# Altium project Altium_008_ESCDesignUdemyV1.PrjPcb
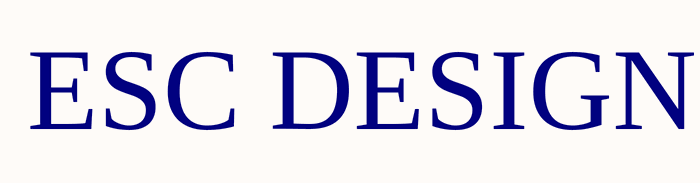
[diagram p0: Introduction.SchDoc]
4 sheets, 57 parts. Net scope: flat (ports and power ports of the same name join across sheets).
Board file: PCB1.PcbDoc
Sheets:
  Introduction.SchDoc
  MP2307.SchDoc
  MosfetDrivers.SchDoc
  Atmega328PB.SchDoc

## Sheet Introduction.SchDoc
size 420 x 297 mm; Author: Denizhan ALTAY; SheetNumber: 1; SheetTotal: 4

### Notes on the sheet
- ESC DESIGN
- THIS DOCUMENT AND THE DATA DISCLOSED HEREIN OR
- HEREWITH IS THE PROPERTY OF ALTIUM LIMITED AND MAY
- BE FREELY DISTRIBUTED IN WHOLE. NO RIGHTS ARE
- RESERVED OR EXPRESS OR IMPLIED WARANTEE GIVEN.
- Title :
- Size :
- Date :
- A3
- Sheet Number :
- Time :
- Revision :
- Author :
- File :

## Sheet MP2307.SchDoc
size 420 x 297 mm; Author: Denizhan ALTAY; SheetNumber: 2; SheetTotal: 4
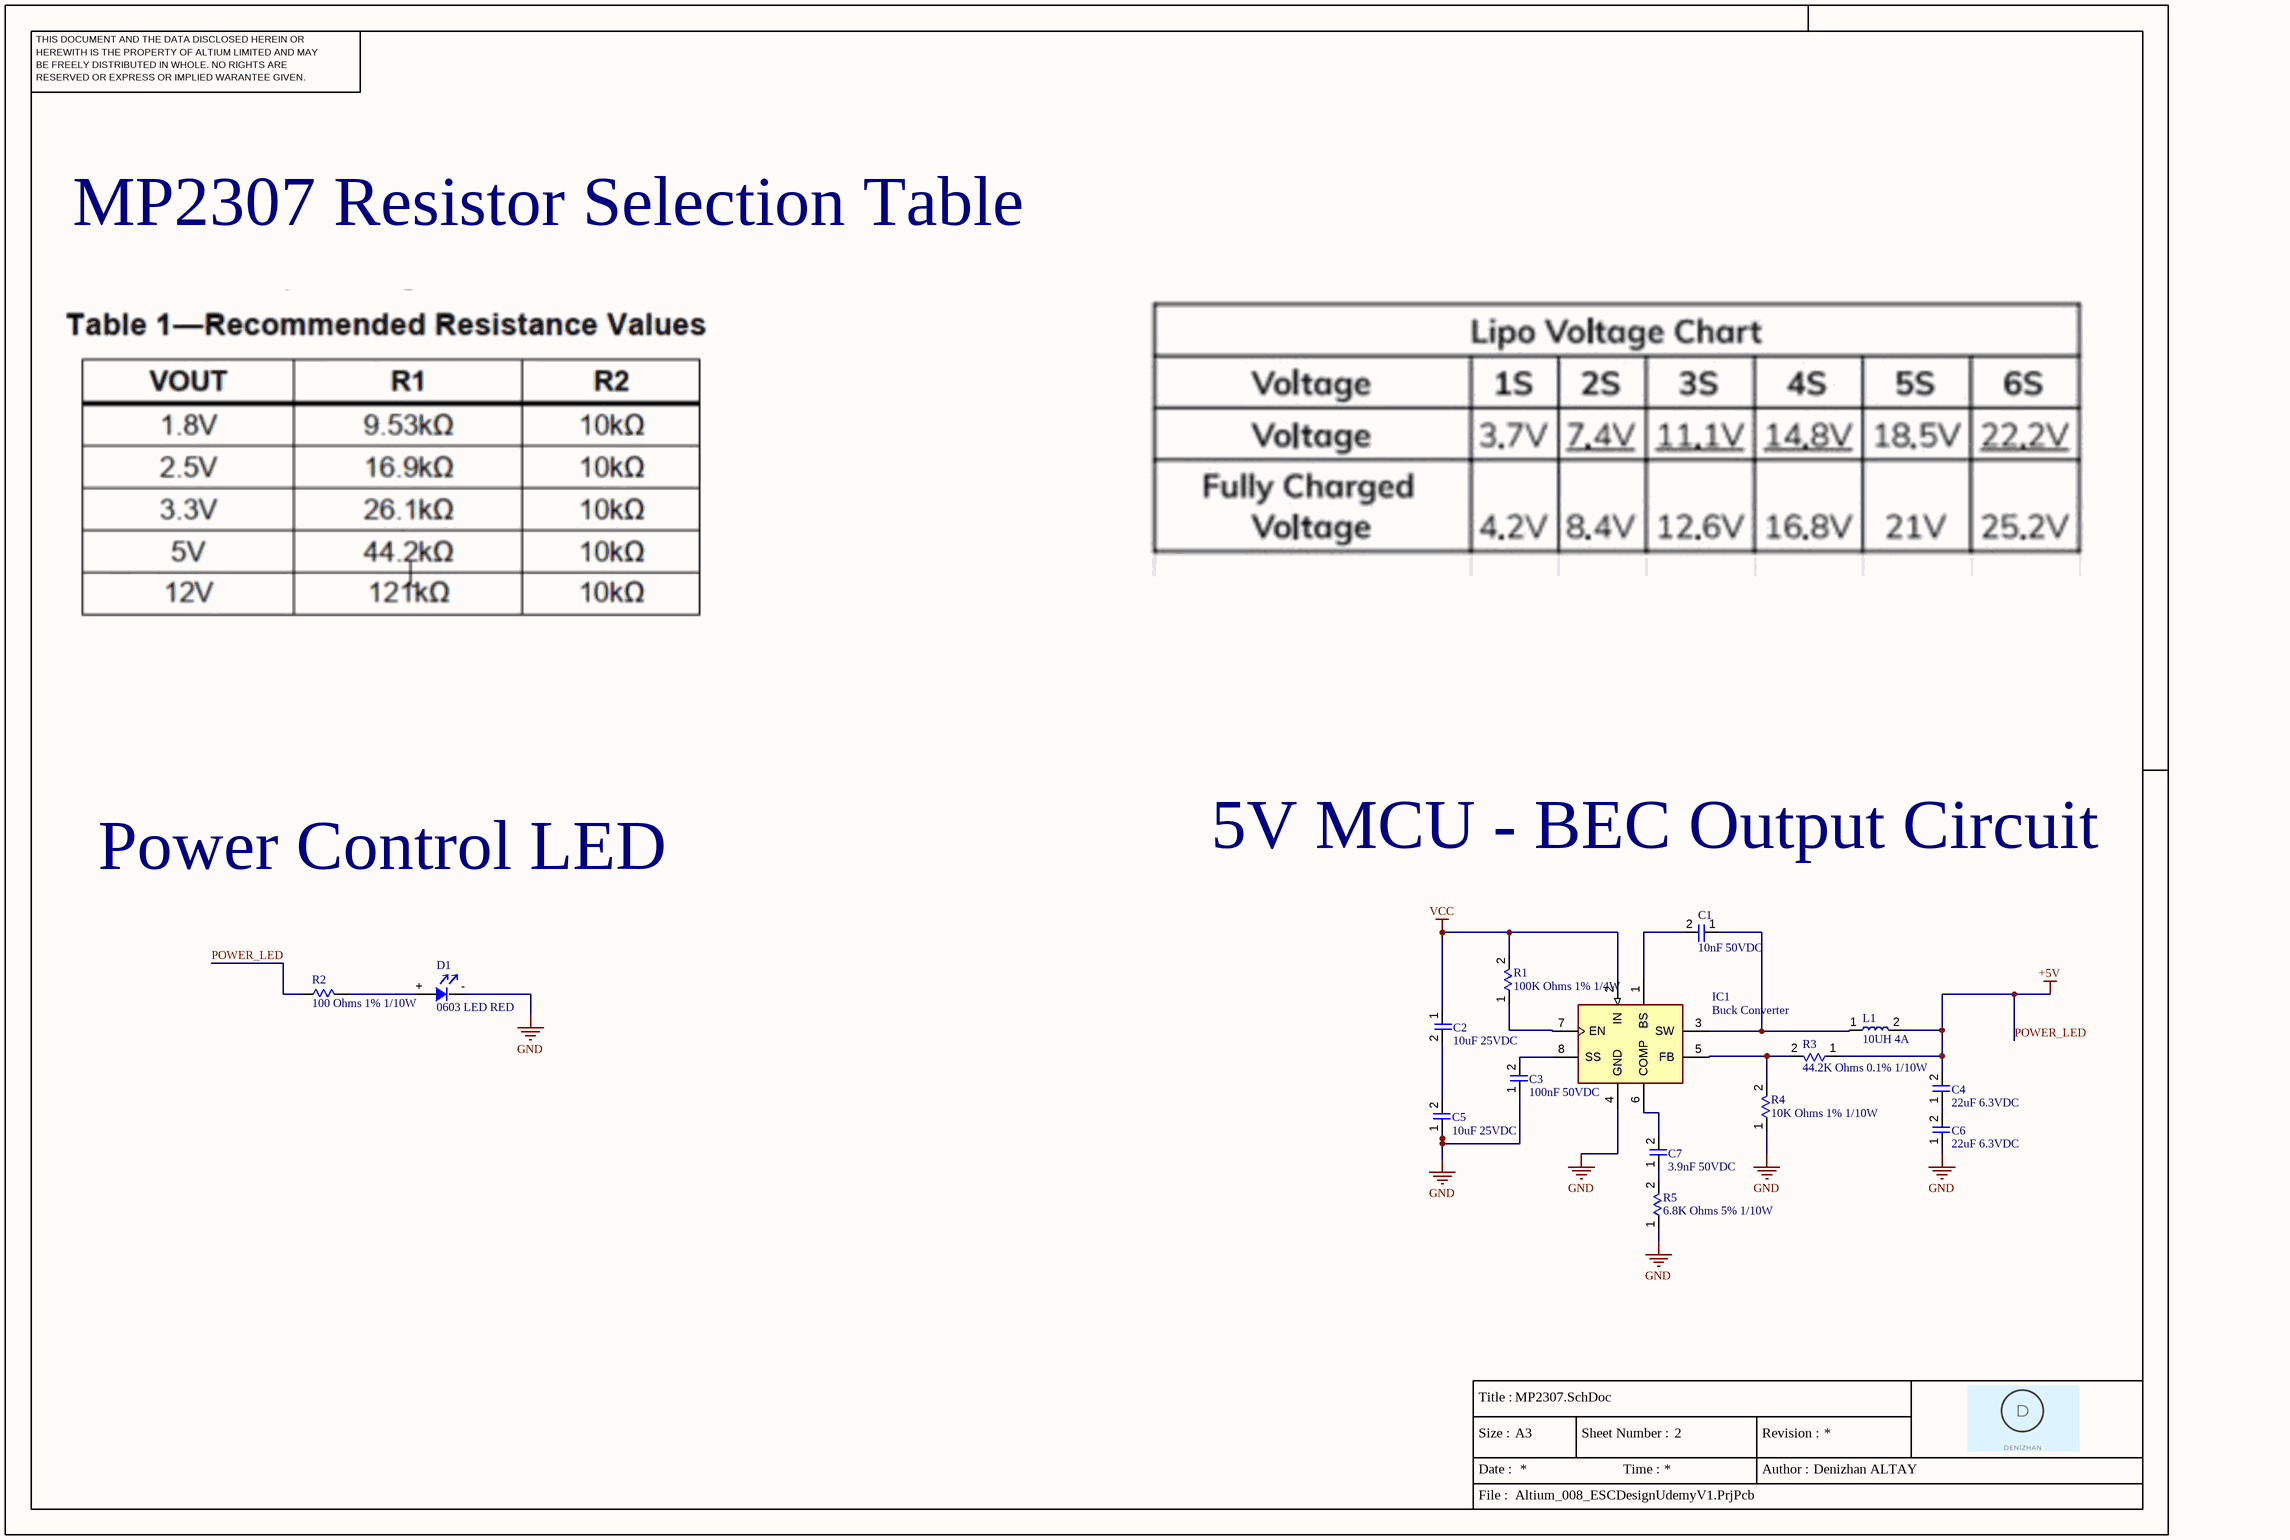
[diagram p1: MP2307.SchDoc]

### Parts
C1  10nF 50VDC  [0603_UnP_Capacitor]
C2  10uF 25VDC  [0603_UnP_Capacitor]
C3  100nF 50VDC  [0603_UnP_Capacitor]
C4  22uF 6.3VDC  [0603_UnP_Capacitor]
C5  10uF 25VDC  [0603_UnP_Capacitor]
C6  22uF 6.3VDC  [0603_UnP_Capacitor]
C7  3.9nF 50VDC  [0603_UnP_Capacitor]
D1  0603 LED RED  [LED Diode 0603]
IC1  Buck Converter  [MP2307_SOIC127P600X170_HS-9N]
L1  10UH 4A  [IHLP-2525CZ-11_Inductor]
R1  100K Ohms 1% 1/4W  [0603_Resistor_Case]
R2  100 Ohms 1% 1/10W  [0603_Resistor_Case]
R3  44.2K Ohms 0.1% 1/10W  [0603_Resistor_Case]
R4  10K Ohms 1% 1/10W  [0603_Resistor_Case]
R5  6.8K Ohms 5% 1/10W  [0603_Resistor_Case]

### Nets
GND: C3.1 C5.1 C6.1 D1.- IC1.4(GND) R4.1 R5.1
POWER_LED: C4.2 L1.2 R2.1 R3.1  [also labelled +5V]
VCC: C2.1 IC1.2(IN) R1.2
NetC1_1: C1.1 IC1.3(SW) L1.1
NetC1_2: C1.2 IC1.1(BS)
NetC2_2: C2.2 C5.2
NetC3_2: C3.2 IC1.8(SS)
NetC4_1: C4.1 C6.2
NetC7_1: C7.1 R5.2
NetC7_2: C7.2 IC1.6(COMP)
NetD1_+: D1.+ R2.2
NetIC1_5: IC1.5(FB) R3.2 R4.2
NetIC1_7: IC1.7(EN) R1.1

### Notes on the sheet
- MP2307 Resistor Selection Table
- Power Control LED
- 5V MCU - BEC Output Circuit
- THIS DOCUMENT AND THE DATA DISCLOSED HEREIN OR
- HEREWITH IS THE PROPERTY OF ALTIUM LIMITED AND MAY
- BE FREELY DISTRIBUTED IN WHOLE. NO RIGHTS ARE
- RESERVED OR EXPRESS OR IMPLIED WARANTEE GIVEN.
- Title :
- Size :
- Date :
- A3
- Sheet Number :
- Time :
- Revision :
- Author :
- File :

### Library data of the parts
C1 = CL10B103KB8NNNC - MLCC (1608) 0603 10nF 50VDC ±10% X7R: Manufacturer: SAMSUNG; Capacitor Type: Unpolarized; Max Working Voltage: 50V; Library Ref: Capacitors; Package / Case: 0603; Capacitor Value: 10nF; Part Number: CL10B103KB8NNNC; ComponentLink1Description: New link; ComponentLink1URL: https://www.ozdisan.com/passive-components/resistors/smt-smd-and-chip-resistors/PS03W4F1003T5E/592727
C2 C5 = MCF03MTX250106 - MLCC 0603 10uF 25VDC ±20% X5R: MCF03MTX250106 - MLCC (1608) 0603 10uF 25VDC ±20% X5R; Manufacturer: VIKING; Capacitor Type: Ceramic; Library Ref: Capacitors; Package / Case: 0603; Capacitor Value: 10uF; Part Number: MCF03MTX250106; ComponentLink1Description: New link; ComponentLink1URL: https://www.ozdisan.com/passive-components/resistors/smt-smd-and-chip-resistors/PS03W4F1003T5E/592727; Max Working Voltage: 25VDC
C3 = MCF03KTB500104 - MLCC 0603 100nF 50VDC ±10% X7R: MCF03KTB500104 - MLCC (1608) 0603 100nF 50VDC ±10% X7R; Manufacturer: VIKING; Part Number: MCF03MTX250106; Capacitor Type: Ceramic; Library Ref: Capacitors; Package / Case: 0603; Capacitor Value: 100nF; ComponentLink1Description: New link; ComponentLink1URL: https://www.ozdisan.com/passive-components/resistors/smt-smd-and-chip-resistors/PS03W4F1003T5E/592727; Max Working Voltage: 50VDC
C4 C6 = CL10A226MQ8NRNC - MLCC (1608) 0603 22uF 6.3VDC ±20% X5R: Manufacturer: SAMSUNG; Part Number: CL10B103KB8NNNC; Capacitor Type: Unpolarized; Max Working Voltage: 6.3V; Library Ref: Capacitors; Package / Case: 0603; Capacitor Value: 22uF; ComponentLink1Description: New link; ComponentLink1URL: https://www.ozdisan.com/passive-components/capacitors/smt-smd-and-mlcc-capacitors/CL10B392KB8NNNC/26336
C7 = CL10B392KB8NNNC - MLCC (1608) 0603 3.9nF 50VDC ±10% X7R: Manufacturer: SAMSUNG; Part Number: CL10B103KB8NNNC; Capacitor Type: Unpolarized; Max Working Voltage: 50V; Library Ref: Capacitors; Package / Case: 0603; Capacitor Value: 3.9nF; ComponentLink1Description: New link; ComponentLink1URL: https://www.ozdisan.com/passive-components/capacitors/smt-smd-and-mlcc-capacitors/CL10B392KB8NNNC/26336
D1 = 0603 LED RED: Type: SMD; Library Ref: LED; Package / Case: 0603; Color: Red
IC1 = MP2307: 3A and 4.75V-23V voltage regulator.; Library Ref: Voltage Regulators; Converter Type: Buck; Package / Case: SMD
L1 = IHLP2525CZER100M11 - INDUCTOR FIXED 10UH 4A 71.2MOHM SMD: Inductance Value: 10 µH; Working Voltage (Max): 50V; Inductor Type: Iron Core; Library Ref: Inductors; Package / Case: THT; Rated Current (Max): 4A
R1 = PS03W4F1003T5E - 0603 100K Ohms 1% 1/4W AUTOMOTIV: RES.(1608) 0603 100K Ohms 1% 1/4W AUTOMOTIV PS03W4F1003T5E; Manufacturer: ROYALOHM; Max Working Voltage: 50V; Library Ref: Resistors; Package / Case: 0603; Power (Watts): 1/4W; Resistor Value: 100K Ohms; Part Number: PS03W4F1003T5E; ComponentLink1Description: New link; ComponentLink1URL: https://www.ozdisan.com/passive-components/resistors/smt-smd-and-chip-resistors/PS03W4F1003T5E/592727
R2 = CQ03SAF1000T5E - 0603 100 Ohms 1% 1/10W AUTOMOTIV: Manufacturer: ROYALOHM; Working Voltage (Max): 75V; Library Ref: Resistors; Package / Case: 0603; Power (Watts): 1/10W; Resistor Value: 100 Ohms; Part Number: CQ03SAF1000T5E; ComponentLink1Description: New link; ComponentLink1URL: https://www.ozdisan.com/passive-components/resistors/smt-smd-and-chip-resistors/PS03W4F1003T5E/592727
R3 = TC0325B4422T5F - 0603 44.2K Ohms 0.1% 1/10W 25PPM: TC0325B4422T5F - RES.(1608) 0603 44.2K Ohms 0.1% 1/10W 25PPM; Manufacturer: ROYALOHM; Part Number: RI0603L104JT; Max Working Voltage: 50V; Library Ref: Resistors; Package / Case: 0603; Power (Watts): 1/10W; Resistor Value: 44.2K Ohms; ComponentLink1Description: New link; ComponentLink1URL: https://www.ozdisan.com/passive-components/resistors/smt-smd-and-chip-resistors/PS03W4F1003T5E/592727
R4 = RC0603FR-0710KL - 0603 10K Ohms 1% 1/10W 100PPM: Manufacturer: HOTTECH; Part Number: PS03W4F1003T5E; Max Working Voltage: 75V; Library Ref: Resistors; Package / Case: 0603; Power (Watts): 1/10W; Resistor Value: 10K Ohms; ComponentLink1Description: New link; ComponentLink1URL: https://www.ozdisan.com/passive-components/resistors/smt-smd-and-chip-resistors/PS03W4F1003T5E/592727
R5 = RC0603JR-076K8L - 0603 6.8K Ohms 5% 1/10W 100PPM: Manufacturer: YAGEO; Max Working Voltage: 75V; Library Ref: Resistors; Package / Case: 0603; Power (Watts): 1/10W; Resistor Value: 6.8K Ohms; Part Number: RC0603JR-076K8L; ComponentLink1Description: New link; ComponentLink1URL: https://www.ozdisan.com/passive-components/resistors/smt-smd-and-chip-resistors/PS03W4F1003T5E/592727

## Sheet MosfetDrivers.SchDoc
size 420 x 297 mm; Author: Denizhan ALTAY; SheetNumber: 3; SheetTotal: 4
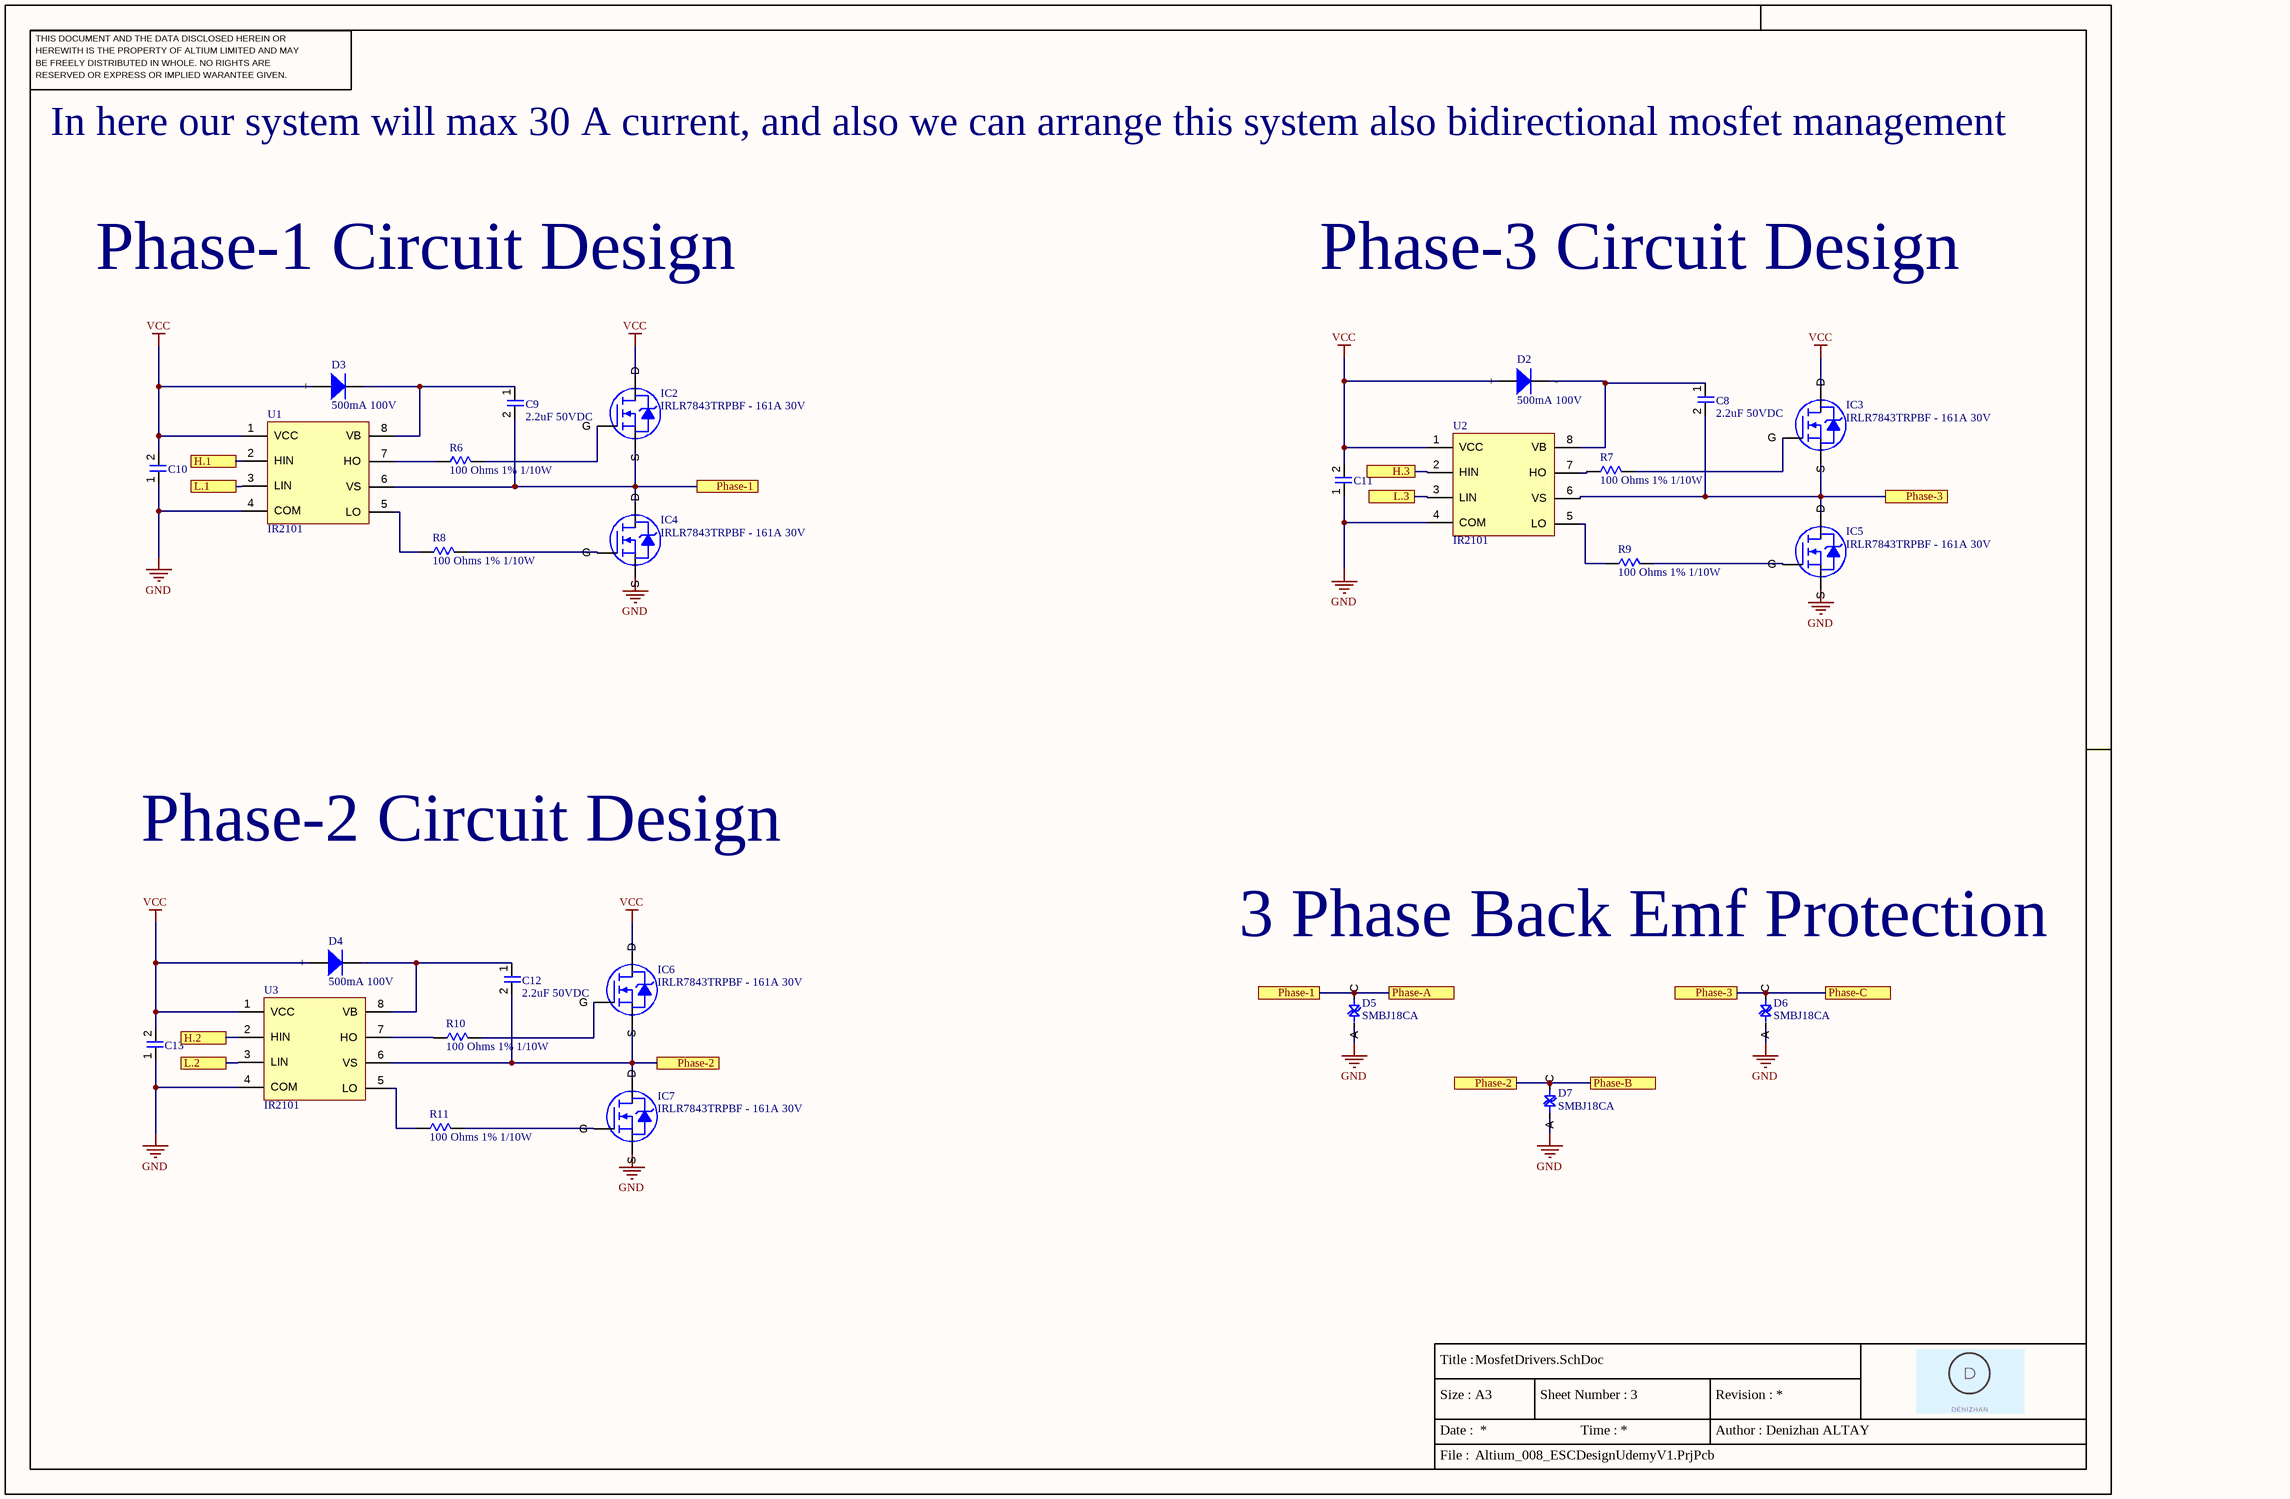
[diagram p2: MosfetDrivers.SchDoc]

### Parts
C8  2.2uF 50VDC  [0603_UnP_Capacitor]
C9  2.2uF 50VDC  [0603_UnP_Capacitor]
C10  10uF 50VDC  [0805_Capacitor_Special_CC0805KKX7R9BB106]  (value not drawn)
C11  10uF 50VDC  [0805_Capacitor_Special_CC0805KKX7R9BB106]  (value not drawn)
C12  2.2uF 50VDC  [0603_UnP_Capacitor]
C13  10uF 50VDC  [0805_Capacitor_Special_CC0805KKX7R9BB106]  (value not drawn)
D2  500mA 100V  [1N4148_Diode]
D3  500mA 100V  [1N4148_Diode]
D4  500mA 100V  [1N4148_Diode]
D5  SMBJ18CA  [SMBJ18CA-TKS]
D6  SMBJ18CA  [SMBJ18CA-TKS]
D7  SMBJ18CA  [SMBJ18CA-TKS]
IC2  IRLR7843TRPBF - 161A 30V  [IRLR7843_DPAK229P991X239-3N]
IC3  IRLR7843TRPBF - 161A 30V  [IRLR7843_DPAK229P991X239-3N]
IC4  IRLR7843TRPBF - 161A 30V  [IRLR7843_DPAK229P991X239-3N]
IC5  IRLR7843TRPBF - 161A 30V  [IRLR7843_DPAK229P991X239-3N]
IC6  IRLR7843TRPBF - 161A 30V  [IRLR7843_DPAK229P991X239-3N]
IC7  IRLR7843TRPBF - 161A 30V  [IRLR7843_DPAK229P991X239-3N]
R6  100 Ohms 1% 1/10W  [0603_Resistor_Case]
R7  100 Ohms 1% 1/10W  [0603_Resistor_Case]
R8  100 Ohms 1% 1/10W  [0603_Resistor_Case]
R9  100 Ohms 1% 1/10W  [0603_Resistor_Case]
R10  100 Ohms 1% 1/10W  [0603_Resistor_Case]
R11  100 Ohms 1% 1/10W  [0603_Resistor_Case]
U1  IR2101  [IR2101_SOIC127P600X175-8N]
U2  IR2101  [IR2101_SOIC127P600X175-8N]
U3  IR2101  [IR2101_SOIC127P600X175-8N]

### Ports
H.1 (see Atmega328PB[4A]), H.2 (see Atmega328PB[3B]), H.3 (see Atmega328PB[3A]), L.1 (see Atmega328PB[4A]), L.2 (see Atmega328PB[3B]), L.3 (see Atmega328PB[3A]), Phase-1 (see Atmega328PB[6B], MosfetDrivers[2B]), Phase-1 (see Atmega328PB[6B], MosfetDrivers[4C]), Phase-2 (see Atmega328PB[6B], MosfetDrivers[2C]), Phase-2 (see Atmega328PB[6B], MosfetDrivers[5C]), Phase-3 (see Atmega328PB[6B], MosfetDrivers[5C]), Phase-3 (see Atmega328PB[6B], MosfetDrivers[6B]), Phase-A, Phase-B, Phase-C

### Nets
GND: C10.1 C11.1 C13.1 D5.2(A) D6.2(A) D7.2(A) IC4.3(S) IC5.3(S) IC7.3(S) U1.4(COM) U2.4(COM) U3.4(COM)
VCC: C10.2 C11.2 C13.2 D2.1(+) D3.1(+) D4.1(+) IC2.4(D) IC3.4(D) IC6.4(D) U1.1(VCC) U2.1(VCC) U3.1(VCC)
NetC8_1: C8.1 D2.2(-) U2.8(VB)
NetC8_2: C8.2 D6.1(C) IC3.3(S) IC5.4(D) U2.6(VS) ; port Phase-3, port Phase-C
NetC9_1: C9.1 D3.2(-) U1.8(VB)
NetC9_2: C9.2 D5.1(C) IC2.3(S) IC4.4(D) U1.6(VS) ; port Phase-1, port Phase-A
NetC12_1: C12.1 D4.2(-) U3.8(VB)
NetC12_2: C12.2 D7.1(C) IC6.3(S) IC7.4(D) U3.6(VS) ; port Phase-2, port Phase-B
NetIC2_1: IC2.1(G) R6.2
NetIC3_1: IC3.1(G) R7.2
NetIC4_1: IC4.1(G) R8.2
NetIC5_1: IC5.1(G) R9.2
NetIC6_1: IC6.1(G) R10.2
NetIC7_1: IC7.1(G) R11.2
NetR6_1: R6.1 U1.7(HO)
NetR7_1: R7.1 U2.7(HO)
NetR8_1: R8.1 U1.5(LO)
NetR9_1: R9.1 U2.5(LO)
NetR10_1: R10.1 U3.7(HO)
NetR11_1: R11.1 U3.5(LO)
NetU1_2: U1.2(HIN) ; port H.1
NetU1_3: U1.3(LIN) ; port L.1
NetU2_2: U2.2(HIN) ; port H.3
NetU2_3: U2.3(LIN) ; port L.3
NetU3_2: U3.2(HIN) ; port H.2
NetU3_3: U3.3(LIN) ; port L.2

### Notes on the sheet
- In here our system will max 30 A current, and also we can arrange this system also bidirectional mosfet management
- Phase-1 Circuit Design
- Phase-3 Circuit Design
- Phase-2 Circuit Design
- 3 Phase Back Emf Protection
- THIS DOCUMENT AND THE DATA DISCLOSED HEREIN OR
- HEREWITH IS THE PROPERTY OF ALTIUM LIMITED AND MAY
- BE FREELY DISTRIBUTED IN WHOLE. NO RIGHTS ARE
- RESERVED OR EXPRESS OR IMPLIED WARANTEE GIVEN.
- Title :
- Size :
- Date :
- A3
- Sheet Number :
- Time :
- Revision :
- Author :
- File :

### Library data of the parts
C8 C9 C12 = UMK107BBJ225KA-T - MLCC 0603 2.2uF 50VDC ±10% X5R: Manufacturer: YUDEN; Capacitor Type: Ceramic; Max Working Voltage: 50V; Library Ref: Capacitors; Package / Case: 0603; Capacitor Value: 2.2uF; Part Number: UMK107BBJ225KA-T; ComponentLink1Description: New link; ComponentLink1URL: https://www.ozdisan.com/passive-components/resistors/smt-smd-and-chip-resistors/PS03W4F1003T5E/592727
C10 C11 C13 = CC0805KKX7R9BB106 - MLCC 0805 10uF 50VDC ±10% X7R: Manufacturer: YAGEO; Capacitor Type: Unpolarized; Library Ref: Capacitors; Package / Case: 0805; Capacitor Value: 10uF; Part Number: CC0805KKX7R9BB106; ComponentLink1Description: New link; ComponentLink1URL: https://www.ozdisan.com/passive-components/capacitors/smt-smd-and-mlcc-capacitors/CL10B392KB8NNNC/26336; Max Working Voltage: 50VDC
D2-D4 = 1N4148-35_AY_10001 - DIODE SWITCHING Single 500mA 100V THT DO35: Library Ref: Diodes; Diode Types: Switching
D5-D7 = SMBJ18CA-TKS - DIODE TVS 600W 18V DO214AA: SMBJ18CA-TKS - DIODE TVS 600W 18V DO214AA (SMB) SMT; MF: THINKING ELECTRONIC; Diode Direction: Bidirectional; Package: SMD; Price: None; Library Ref: Diodes; MP: SMBJ18CA-TKS; Availability: Available; Type: TVS
IC2-IC7 = IRLR7843TRPBF - MOSFET DIS.161A 30V N-CH TO252(DPAK) HEXFET SMT: Mosfet Type: N; Library Ref: Mosfets; Package / Case: D-Pack
R6-R11 = CQ03SAF1000T5E - 0603 100 Ohms 1% 1/10W AUTOMOTIV: as R2 on sheet MP2307; Library Ref: Resistors; Package / Case: 0603; Power (Watts): 1/10W; Resistor Value: 100 Ohms; Part Number: CQ03SAF1000T5E; ComponentLink1Description: New link; ComponentLink1URL: https://www.ozdisan.com/passive-components/resistors/smt-smd-and-chip-resistors/PS03W4F1003T5E/592727
U1-U3 = IR2101: High Speed power MOSFET and IGBT driver; Library Ref: Mosfet Controllers

## Sheet Atmega328PB.SchDoc
size 420 x 297 mm; Author: Denizhan ALTAY; SheetNumber: 4; SheetTotal: 4
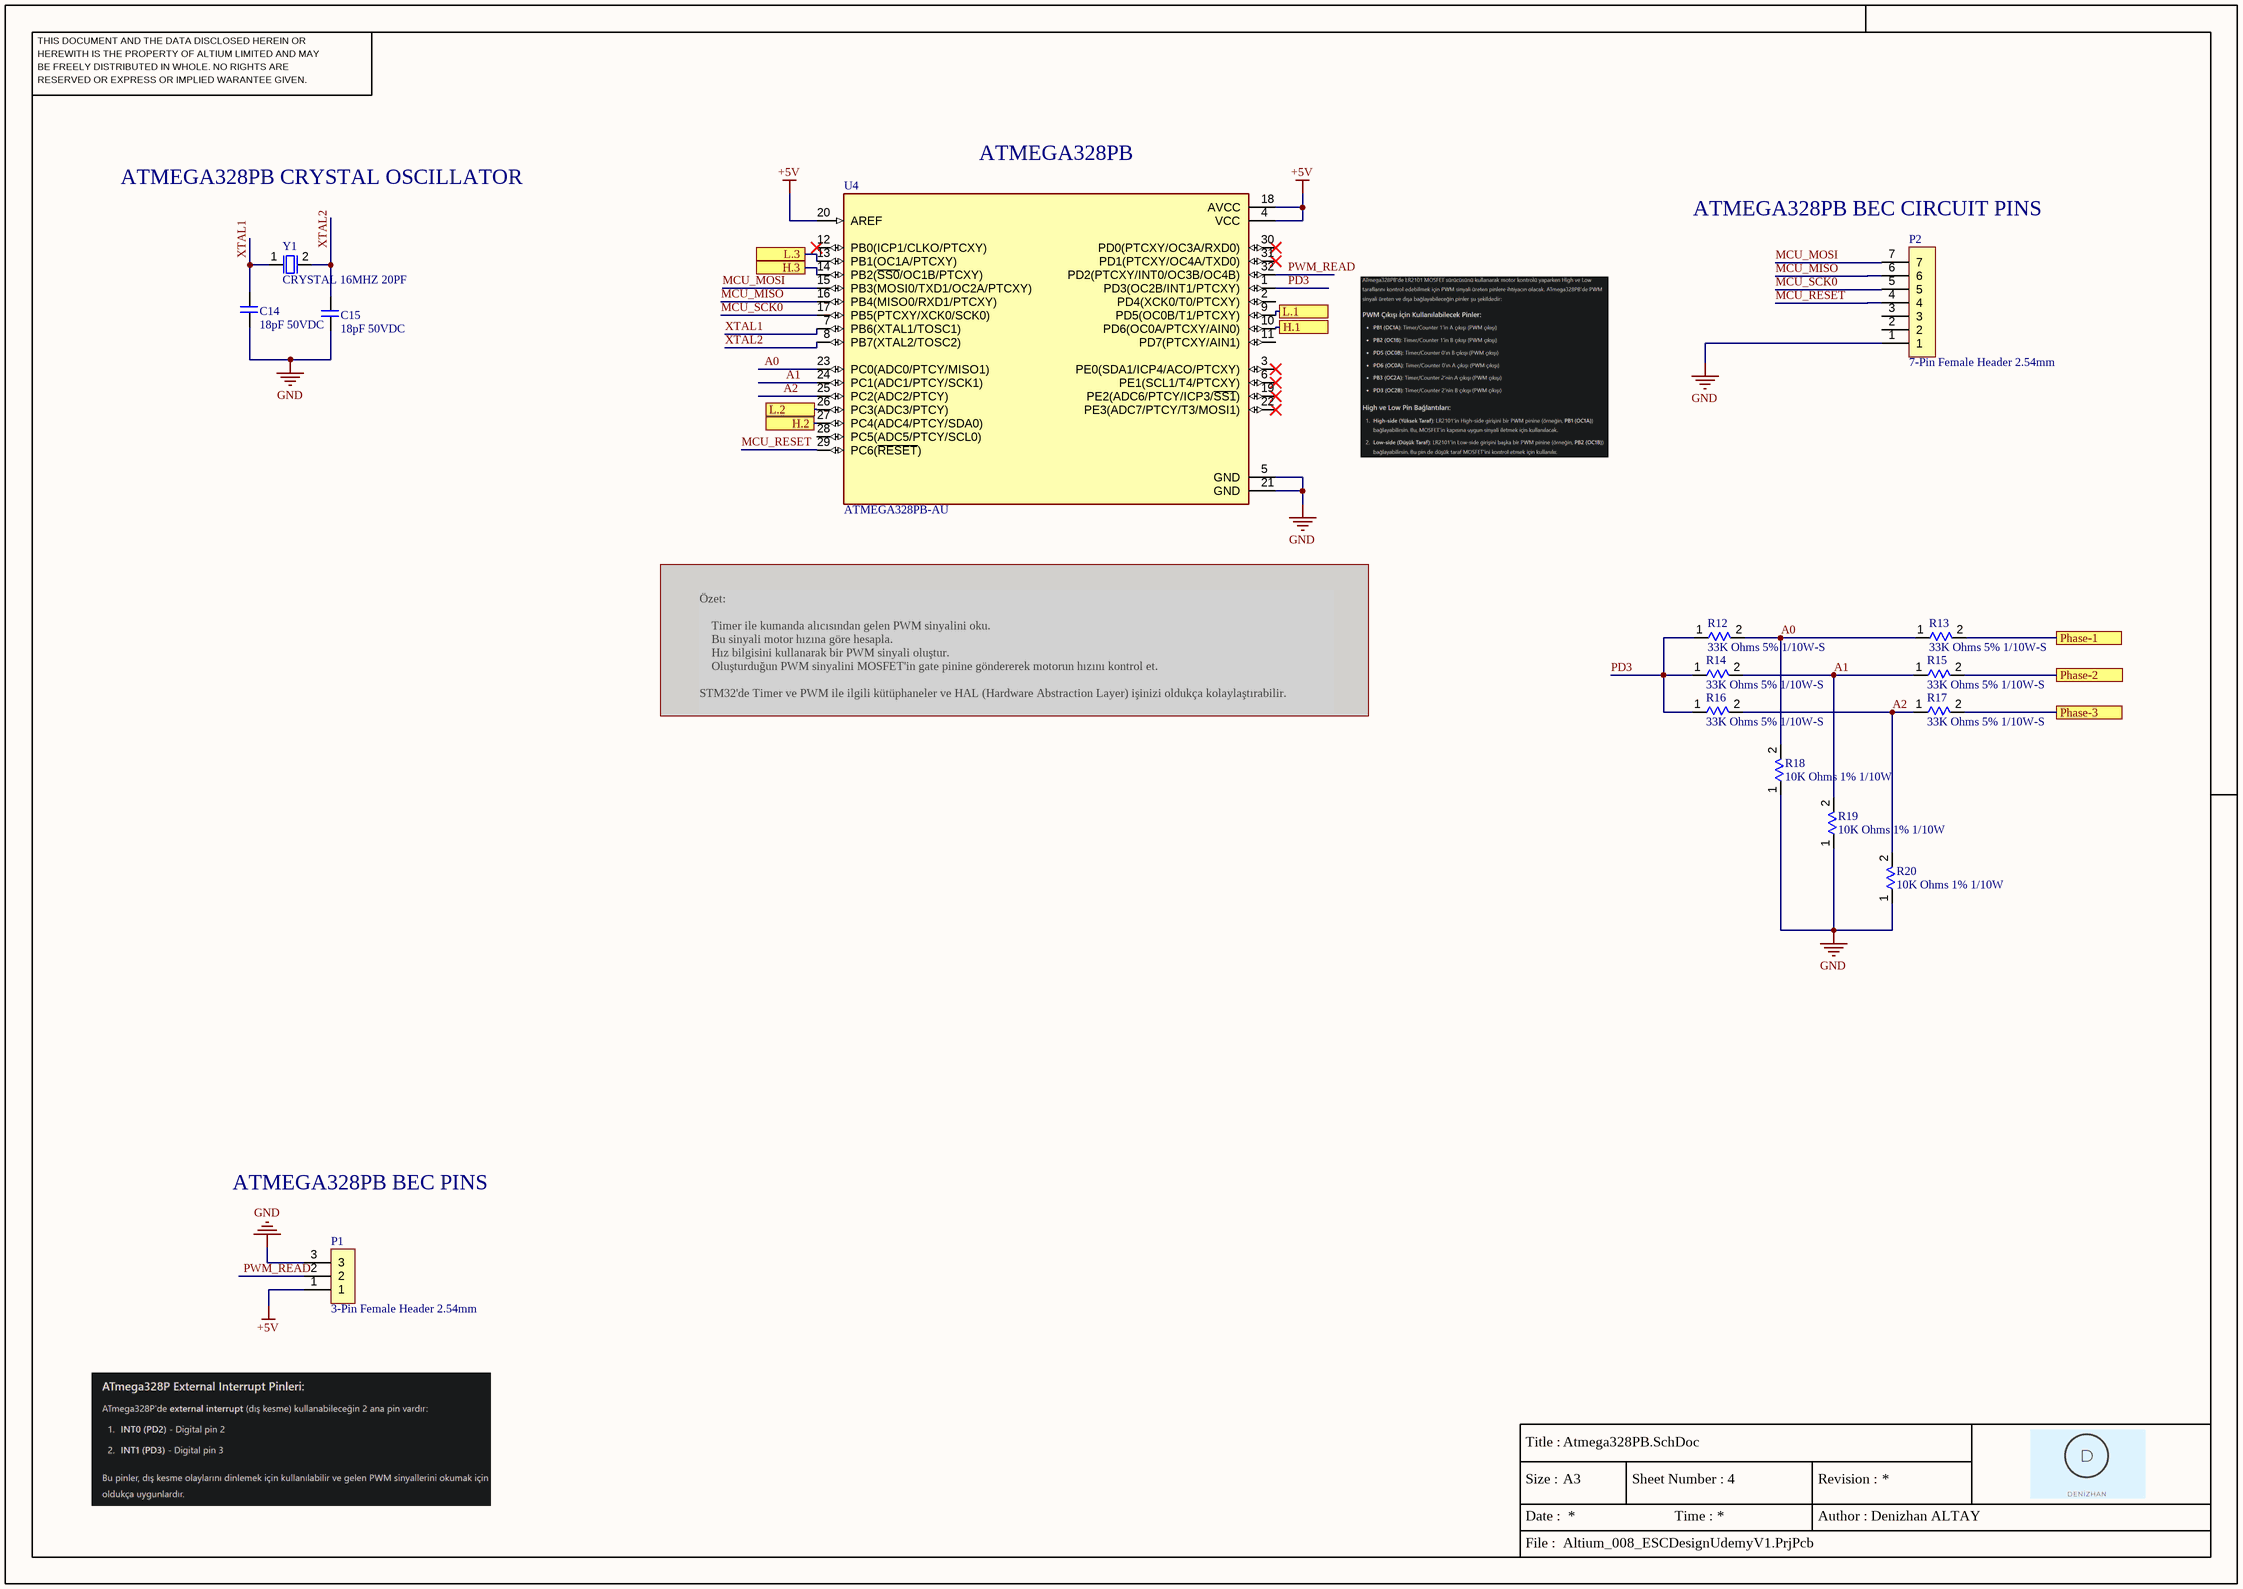
[diagram p3: Atmega328PB.SchDoc]

### Parts
C14  18pF 50VDC  [0603_UNP_Cap]
C15  18pF 50VDC  [0603_UNP_Cap]
P1  3-Pin Female Header 2.54mm  [1x3 Pin Female Header 2.54mm]
P2  7-Pin Female Header 2.54mm  [Single 7-Pin (2.54mm) Female Header]
R12  33K Ohms 5% 1/10W-S  [0603_Resistor_Case]
R13  33K Ohms 5% 1/10W-S  [0603_Resistor_Case]
R14  33K Ohms 5% 1/10W-S  [0603_Resistor_Case]
R15  33K Ohms 5% 1/10W-S  [0603_Resistor_Case]
R16  33K Ohms 5% 1/10W-S  [0603_Resistor_Case]
R17  33K Ohms 5% 1/10W-S  [0603_Resistor_Case]
R18  10K Ohms 1% 1/10W  [0603_Resistor_Case]
R19  10K Ohms 1% 1/10W  [0603_Resistor_Case]
R20  10K Ohms 1% 1/10W  [0603_Resistor_Case]
U4  ATMEGA328PB-AU  [ATMEGA328PB-AU]
Y1  CRYSTAL 16MHZ 20PF  [16MHZ_CrsytalOscillator]

### Ports
H.1 (see MosfetDrivers[1B]), H.2 (see MosfetDrivers[1C]), H.3 (see MosfetDrivers[4B]), L.1 (see MosfetDrivers[1B]), L.2 (see MosfetDrivers[1C]), L.3 (see MosfetDrivers[4B]), Phase-1 (see MosfetDrivers[2B], MosfetDrivers[4C]), Phase-2 (see MosfetDrivers[2C], MosfetDrivers[5C]), Phase-3 (see MosfetDrivers[5C], MosfetDrivers[6B])

### Nets
+5V: P1.1 U4.4(VCC) U4.18(AVCC) U4.20(AREF)  [project net POWER_LED]
GND: C14.1 C15.1 P1.3 P2.1 R18.1 R19.1 R20.1 U4.5(GND) U4.21(GND)
A0: R12.2 R13.1 R18.2 U4.23(PC0(ADC0/PTCY/MISO1))
A1: R14.2 R15.1 R19.2 U4.24(PC1(ADC1/PTCY/SCK1))
A2: R16.2 R17.1 R20.2 U4.25(PC2(ADC2/PTCY))
MCU_MISO: P2.6 U4.16(PB4(MISO0/RXD1/PTCXY))
MCU_MOSI: P2.7 U4.15(PB3(MOSI0/TXD1/OC2A/PTCXY))
MCU_RESET: P2.4 U4.29(PC6(~{RESET}))
MCU_SCK0: P2.5 U4.17(PB5(PTCXY/XCK0/SCK0))
PD3: R12.1 R14.1 R16.1 U4.1(PD3(OC2B/INT1/PTCXY))
PWM_READ: P1.2 U4.32(PD2(PTCXY/INT0/OC3B/OC4B))
XTAL1: C14.2 U4.7(PB6(XTAL1/TOSC1)) Y1.1
XTAL2: C15.2 U4.8(PB7(XTAL2/TOSC2)) Y1.2
NetC8_2: R17.2 ; port Phase-3
NetC9_2: R13.2 ; port Phase-1
NetC12_2: R15.2 ; port Phase-2
NetU1_2: U4.10(PD6(OC0A/PTCXY/AIN0)) ; port H.1
NetU1_3: U4.9(PD5(OC0B/T1/PTCXY)) ; port L.1
NetU2_2: U4.14(PB2(~{SS0}/OC1B/PTCXY)) ; port H.3
NetU2_3: U4.13(PB1(OC1A/PTCXY)) ; port L.3
NetU3_2: U4.27(PC4(ADC4/PTCY/SDA0)) ; port H.2
NetU3_3: U4.26(PC3(ADC3/PTCY)) ; port L.2

Not connected (* = marked no-connect by the designer): P2 2 3; U4 2(PD4(XCK0/T0/PTCXY)) 3(PE0(SDA1/ICP4/ACO/PTCXY))* 6(PE1(SCL1/T4/PTCXY))* 11(PD7(PTCXY/AIN1)) 12(PB0(ICP1/CLKO/PTCXY))* 19(PE2(ADC6/PTCY/ICP3/~{SS1}))* 22(PE3(ADC7/PTCY/T3/MOSI1))* 28(PC5(ADC5/PTCY/SCL0)) 30(PD0(PTCXY/OC3A/RXD0))* 31(PD1(PTCXY/OC4A/TXD0))*

### Notes on the sheet
- ATMEGA328PB CRYSTAL OSCILLATOR
- (near U4) ATMEGA328PB
- (near P2) ATMEGA328PB BEC CIRCUIT PINS
- Özet:
  Timer ile kumanda alıcısından gelen PWM sinyalini oku.
  Bu sinyali motor hızına göre hesapla.
  Hız bilgisini kullanarak bir PWM sinyali oluştur.
  Oluşturduğun PWM sinyalini MOSFET'in gate pinine göndererek motorun hızını kontrol et.
  STM32'de Timer ve PWM ile ilgili kütüphaneler ve HAL (Hardware Abstraction Layer) işinizi oldukça kolaylaştırabilir.
- ATMEGA328PB BEC PINS
- THIS DOCUMENT AND THE DATA DISCLOSED HEREIN OR
- HEREWITH IS THE PROPERTY OF ALTIUM LIMITED AND MAY
- BE FREELY DISTRIBUTED IN WHOLE. NO RIGHTS ARE
- RESERVED OR EXPRESS OR IMPLIED WARANTEE GIVEN.
- Title :
- Size :
- Date :
- A3
- Sheet Number :
- Time :
- Revision :
- Author :
- File :

### Library data of the parts
C14 C15 = MCF03JTN500180 - MLCC 0603 18pF 50VDC ±5% C0G (NP0): MCF03JTN500180 - MLCC (1608) 0603 18pF 50VDC ±5% C0G (NP0); Manufacturer: VIKING; Part Number: MCF03MTX250106; Capacitor Type: Ceramic; Library Ref: Capacitors; Package / Case: 0603; Capacitor Value: 18pF; ComponentLink1Description: New link; ComponentLink1URL: https://www.ozdisan.com/passive-components/resistors/smt-smd-and-chip-resistors/PS03W4F1003T5E/592727; Max Working Voltage: 50VDC
P1 = Single 3-Pin (2.54mm) Female Header: Library Ref: Header
P2 = Single 7-Pin (2.54mm) Female Header: Library Ref: Header
R12-R17 = 0603SAJ0333T5E - RES. 0603 33K Ohms 5% 1/10W-S 100PPM: 0603SAJ0333T5E - RES.(1608) 0603 33K Ohms 5% 1/10W-S 100PPM; Manufacturer: ROYALOHM; Power (Watts): 1/10W; Working Voltage (Max): 75V; Library Ref: Resistors; Package / Case: 0603; Resistor Value: 33K Ohms; Part Number: 0603SAJ0333T5E; ComponentLink1Description: New link; ComponentLink1URL: https://www.ozdisan.com/passive-components/resistors/smt-smd-and-chip-resistors/PS03W4F1003T5E/592727
R18-R20 = RC0603FR-0710KL - 0603 10K Ohms 1% 1/10W 100PPM: as R4 on sheet MP2307; Library Ref: Resistors; Package / Case: 0603; Power (Watts): 1/10W; Resistor Value: 10K Ohms; ComponentLink1Description: New link; ComponentLink1URL: https://www.ozdisan.com/passive-components/resistors/smt-smd-and-chip-resistors/PS03W4F1003T5E/592727
U4 = ATMEGA328PB-AU: ATmega Series 20 MHz 32 KB Flash 2 KB SRAM 8-Bit Microcontroller - TQFP-32; MF: {'manufacturer': u'Microchip Technology'}; Price: None; Availability: Unavailable; Package / Case: SMD; Library Ref: Microprocessors; Name: ATMEGA328PB-AU
Y1 = AS-16.000-20-SMD-TR - CRYSTAL 16.0000MHZ 20PF SMD: Button Size: 12mm; Library Ref: Oscillator; Package / Case: SMD; Oscillator Type: Crystal; Part Number: AS-16.000-20-SMD-TR

## Nets that join several sheets
GND: MP2307 (7 pins), MosfetDrivers (12 pins), Atmega328PB (9 pins)
POWER_LED: MP2307 (C4.2 L1.2 R2.1 R3.1), Atmega328PB (P1.1 U4.4 U4.18 U4.20)
VCC: MP2307 (C2.1 IC1.2 R1.2), MosfetDrivers (12 pins)
NetC8_2: MosfetDrivers (5 pins), Atmega328PB (R17.2)
NetC9_2: MosfetDrivers (5 pins), Atmega328PB (R13.2)
NetC12_2: MosfetDrivers (5 pins), Atmega328PB (R15.2)
NetU1_2: MosfetDrivers (U1.2), Atmega328PB (U4.10)
NetU1_3: MosfetDrivers (U1.3), Atmega328PB (U4.9)
NetU2_2: MosfetDrivers (U2.2), Atmega328PB (U4.14)
NetU2_3: MosfetDrivers (U2.3), Atmega328PB (U4.13)
NetU3_2: MosfetDrivers (U3.2), Atmega328PB (U4.27)
NetU3_3: MosfetDrivers (U3.3), Atmega328PB (U4.26)